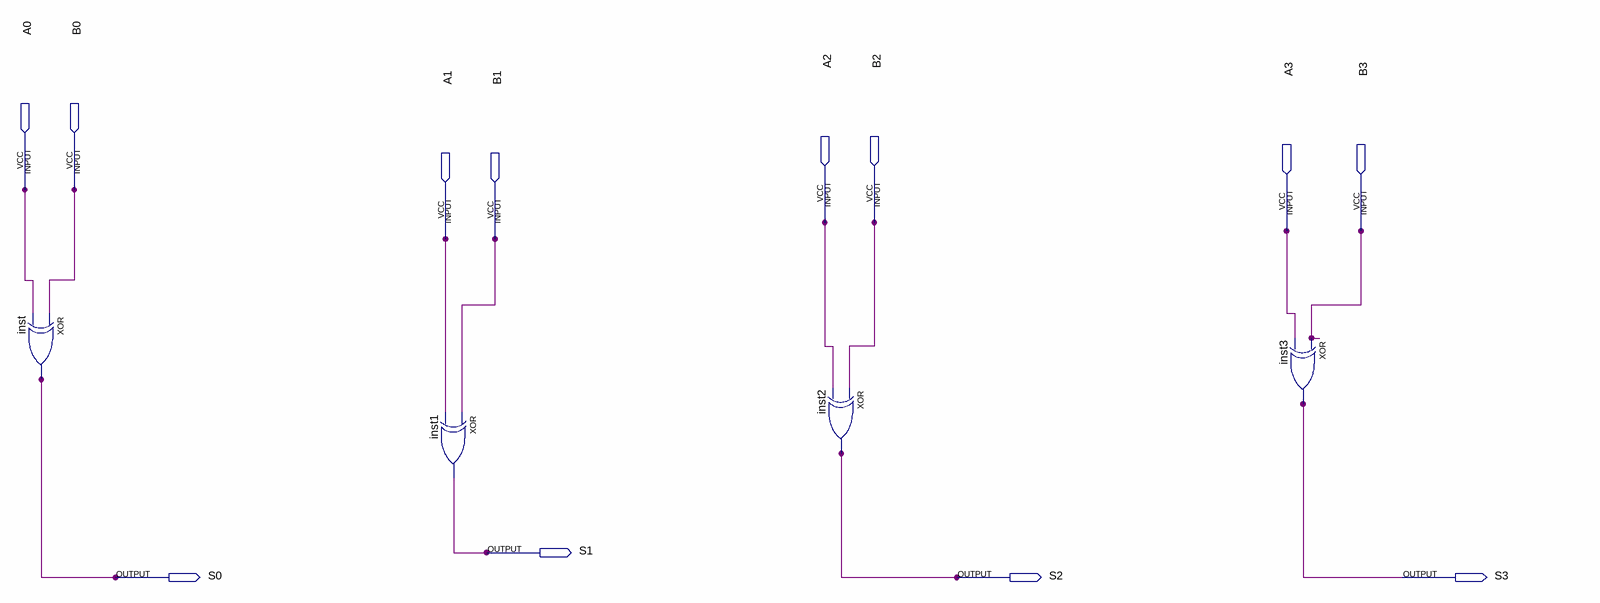
[diagram p0: schematic sheet]
// Quartus schematic ALUXOR.bdf as structural Verilog: 4 symbols, 12 pins
module ALUXOR (
  input  A0,
  input  B0,
  input  A2,
  input  B2,
  input  A3,
  input  B3,
  input  A1,
  input  B1,
  output S1,
  output S0,
  output S2,
  output S3
);

  xor inst (S0, B0, A0);
  xor inst1 (S1, B1, A1);
  xor inst2 (S2, B2, A2);
  xor inst3 (S3, B3, A3);
endmodule
